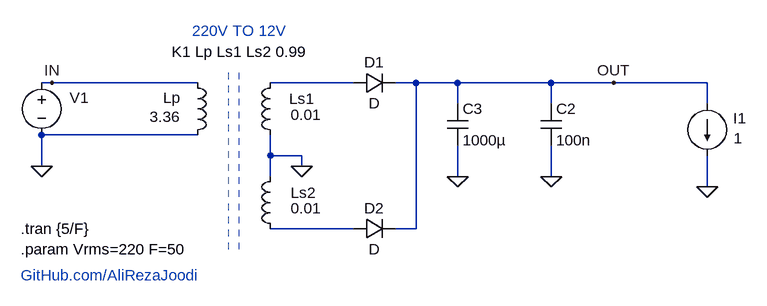
[diagram p0: schematic v1.0.asc]
v1.0.asc, the LTspice schematic file:
Version 4.1
SHEET 1 1736 680
WIRE -240 160 -256 160
WIRE -16 160 -240 160
WIRE 224 160 96 160
WIRE 320 160 288 160
WIRE 384 160 320 160
WIRE 528 160 384 160
WIRE 624 160 528 160
WIRE 768 160 624 160
WIRE 384 192 384 160
WIRE 528 192 528 160
WIRE 768 192 768 160
WIRE -16 240 -256 240
WIRE 96 272 96 240
WIRE 144 272 96 272
WIRE -256 288 -256 240
WIRE 144 288 144 272
WIRE 96 304 96 272
WIRE 384 304 384 256
WIRE 528 304 528 256
WIRE 768 320 768 272
WIRE 224 384 96 384
WIRE 320 384 320 160
WIRE 320 384 288 384
FLAG 624 160 OUT
FLAG 768 320 0
FLAG -256 288 0
FLAG 144 288 0
FLAG 384 304 0
FLAG 528 304 0
FLAG -240 160 IN
SYMBOL voltage -256 144 R0
WINDOW 0 43 39 Left 2
WINDOW 3 -248 72 Invisible 2
WINDOW 123 0 0 Left 0
WINDOW 39 -162 108 Left 2
SYMATTR InstName V1
SYMATTR Value SINE(0 {Vrms*1.414} {F})
SYMBOL diode 224 176 R270
WINDOW 0 32 32 VTop 2
WINDOW 3 0 32 VBottom 2
SYMATTR InstName D1
SYMBOL cap 512 192 R0
SYMATTR InstName C2
SYMATTR Value 100n
SYMBOL cap 368 192 R0
SYMATTR InstName C3
SYMATTR Value 1000µ
SYMBOL ind -32 256 M180
WINDOW 0 -37 73 Left 2
WINDOW 3 -58 44 Left 2
SYMATTR InstName Lp
SYMATTR Value 3.36
SYMATTR Type ind
SYMATTR SpiceLine Ipk=0.2 Rser=82 Rpar=48k
SYMBOL ind 112 256 R180
WINDOW 0 -52 72 Left 2
WINDOW 3 -15 47 Right 2
SYMATTR InstName Ls1
SYMATTR Value 0.01
SYMATTR Type ind
SYMATTR SpiceLine Ipk=3 Rser=0.3
SYMBOL ind 112 400 R180
WINDOW 0 -54 71 Left 2
WINDOW 3 -15 47 Right 2
SYMATTR InstName Ls2
SYMATTR Value 0.01
SYMATTR Type ind
SYMATTR SpiceLine Ipk=3 Rser=0.3
SYMBOL diode 224 400 R270
WINDOW 0 32 32 VTop 2
WINDOW 3 0 32 VBottom 2
SYMATTR InstName D2
SYMBOL current 768 192 R0
WINDOW 0 40 22 Left 2
WINDOW 3 41 53 Left 2
WINDOW 123 0 0 Left 0
WINDOW 39 0 0 Left 0
SYMATTR InstName I1
SYMATTR Value 1
TEXT -288 384 Left 2 !.tran {5/F}
TEXT -56 112 Left 2 !K1 Lp Ls1 Ls2 0.99
TEXT -24 80 Left 2 ;220V TO 12V
TEXT -288 416 Left 2 !.param Vrms=220 F=50
TEXT -288 456 Left 2 ;GitHub.com/AliRezaJoodi
LINE Normal 32 416 32 144 2
LINE Normal 32 416 32 144 2
LINE Normal 48 416 48 144 2

The netlist it stands for:
* v1.0.asc
V1 IN 0 SINE(0 {Vrms*1.414} {F})
D1 N001 OUT D
C2 OUT 0 100n
C3 OUT 0 1000µ
Lp 0 IN 3.36 Ipk=0.2 Rser=82 Rpar=48k
Ls1 0 N001 0.01 Ipk=3 Rser=0.3
Ls2 N002 0 0.01 Ipk=3 Rser=0.3
D2 N002 OUT D
I1 OUT 0 1
.model D D
.lib standard.dio
.tran {5/F}
K1 Lp Ls1 Ls2 0.99
* 220V TO 12V
.param Vrms=220 F=50
* GitHub.com/AliRezaJoodi
.backanno
.end